# EAGLE design SOIC-28 v10 (EAGLE 6.2)
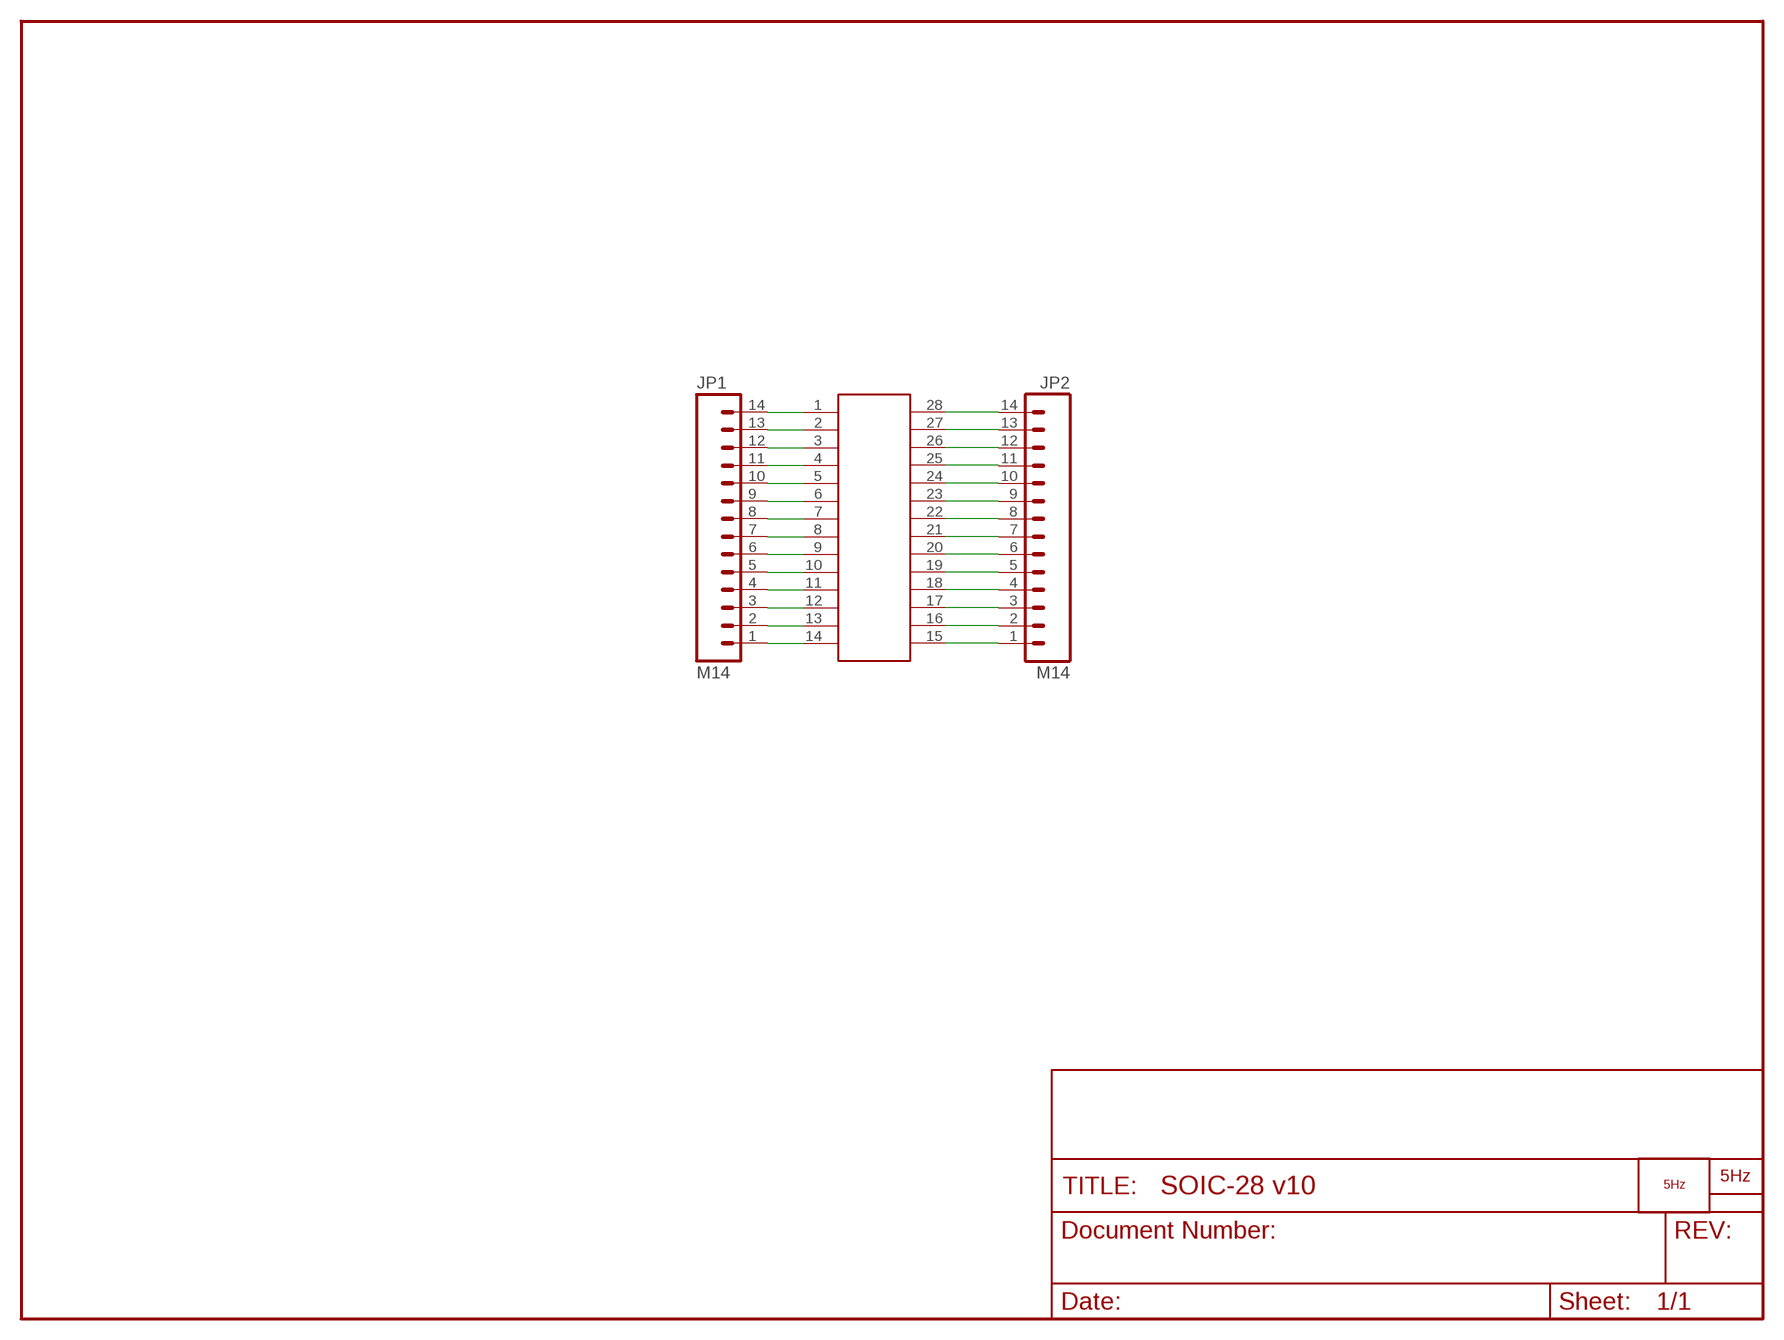
[diagram p0: schematic, sheet 1]

## Parts
JP1  M14  [1X14]
JP2  M14  [1X14]
LOGO1  LOGO_5HZ_MAIN_5MM  [5HZ_LOGO_MAIN_5MM]
U$1  SOIC-28SOIC-28  [SOIC-28]
U$2  LOGO2_SILK10MM  [LOGO2_10MM]

## Nets
N$1: JP1.1 U$1.14
N$2: JP1.2 U$1.13
N$3: JP1.3 U$1.12
N$4: JP1.4 U$1.11
N$5: JP1.5 U$1.10
N$6: JP1.6 U$1.9
N$7: JP1.7 U$1.8
N$8: JP1.8 U$1.7
N$9: JP1.9 U$1.6
N$10: JP1.10 U$1.5
N$11: JP1.11 U$1.4
N$12: JP1.12 U$1.3
N$13: JP1.13 U$1.2
N$14: JP1.14 U$1.1
N$15: JP2.1 U$1.15
N$16: JP2.2 U$1.16
N$17: JP2.3 U$1.17
N$18: JP2.4 U$1.18
N$19: JP2.5 U$1.19
N$20: JP2.6 U$1.20
N$21: JP2.7 U$1.21
N$22: JP2.8 U$1.22
N$23: JP2.9 U$1.23
N$24: JP2.10 U$1.24
N$25: JP2.11 U$1.25
N$26: JP2.12 U$1.26
N$27: JP2.13 U$1.27
N$28: JP2.14 U$1.28

## Library data of the parts
JP1 JP2 = SparkFun:M14: Header 14 Standard 14-pin 0.1" header. Use with straight break away headers (SKU : PRT-00116), right angle break away headers (PRT-00553), swiss pins (PRT-00743), machine pins (PRT-00117), and female headers (PRT-00115).
LOGO1 = 5hz-electronica:LOGO_5HZ: Logotipo 5Hz "según Pedro"
U$1 = MAÑE:SOIC-28
U$2 = LOGO:LOGO2_SILK: PRINCIPAL

## Board
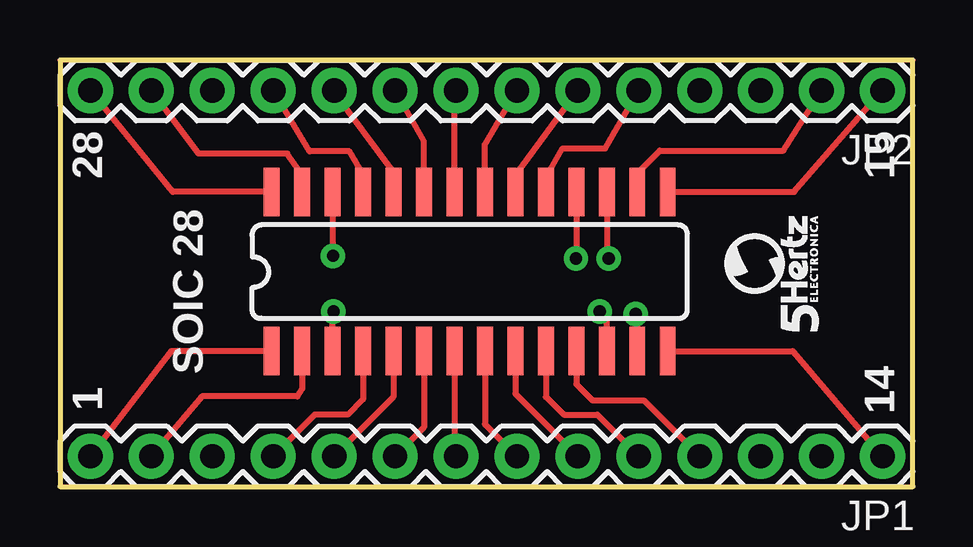
[diagram p1: board, top side]
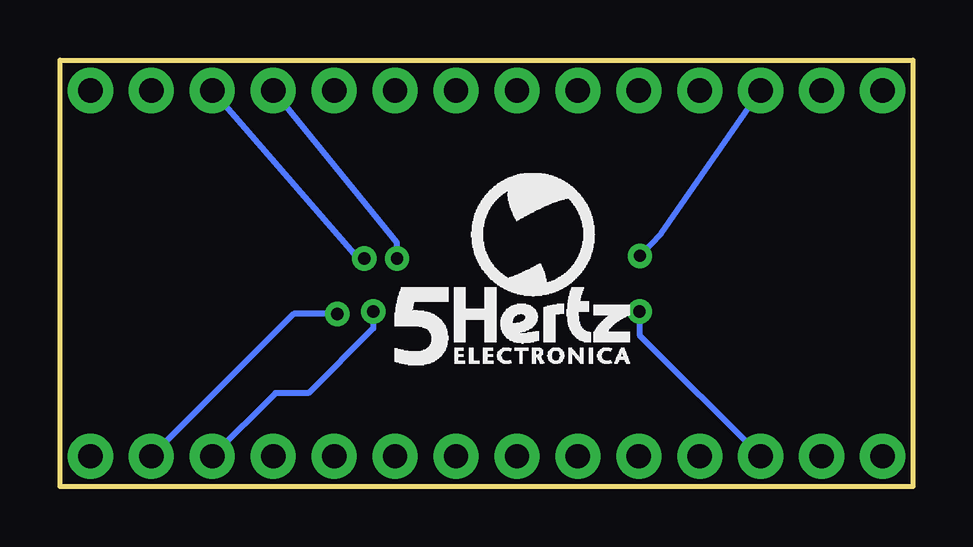
[diagram p2: board, bottom side, seen from below]

Size 35.56 x 17.78 mm. Coordinates in mm from the lower left corner, seen from the top.
Outline: 0,0 35.56,0 35.56,17.78 0,17.78 0,0
Copper layers (1*16): Top 0.035mm / dielectric 1.5mm / Bottom 0.035mm
Design rules: minimum track width 8mil, minimum drill 20mil, track to track 8mil, track to pad 8mil, pad to pad 8mil, via to via 8mil, smd to smd 8mil, copper to edge 10mil, drill to drill 8mil, minimum pad ring 12mil, minimum via ring 10mil, stop-mask expansion 4mil, vias tented up to drill 25mil, thermal gap 10mil

### Footprints (pad centres in the part's own frame; a part is rotated, then mirrored left to right if it is on the bottom)
1X14 = drill 1.016 pad 1.88: 1 0,0; 2 2.54,0; 3 5.08,0; 4 7.62,0; 5 10.16,0; 6 12.7,0; 7 15.24,0; 8 17.78,0; 9 20.32,0; 10 22.86,0; 11 25.4,0; 12 27.94,0; 13 30.48,0; 14 33.02,0
SOIC-28 = smd 0.66 x 2.032: 1 -7.685,-3.285; 2 -6.415,-3.285; 3 -5.145,-3.285; 4 -3.875,-3.285; 5 -2.605,-3.285; 6 -1.335,-3.285; 7 -0.065,-3.285; 8 1.205,-3.285; 9 2.475,-3.285; 10 3.745,-3.285; 11 5.015,-3.285; 12 6.285,-3.285; 13 7.555,-3.285; 14 8.825,-3.285; 15 8.825,3.345; 16 7.555,3.345; 17 6.285,3.345; 18 5.015,3.345; 19 3.745,3.345; 20 2.475,3.345; 21 1.205,3.345; 22 -0.065,3.345; 23 -1.335,3.345; 24 -2.605,3.345; 25 -3.875,3.345; 26 -5.145,3.345; 27 -6.415,3.345; 28 -7.685,3.345

### Placement (x,y rotation side)
JP1  34.29,1.27 180 top
JP2  34.29,16.51 180 top
LOGO1  31.62,6.48 90 top
U$1  16.51,8.94 0 top
U$2  21.59,5.08 0 bottom

### Tracks (layer width: path | path; a pad name or v marks a point on that pad's centre or on a via)
N$1
  Top 0.254: U$1.14 30.54,5.65 JP1.1
N$2  (via drill 0.51)
  Top 0.254: U$1.13 24.07,7.13 v24,7.2
  Bottom 0.254: v24,7.2 25.82,7.2 JP1.2
N$3  (via drill 0.51)
  Top 0.254: U$1.12 22.8,7 v22.5,7.3
  Bottom 0.254: v22.5,7.3 22.5,6.6 25.2,3.9 26.58,3.9 JP1.3
N$4
  Top 0.254: U$1.11 21.52,4.28 22.2,3.6 24.34,3.6 JP1.4
N$5
  Top 0.254: U$1.10 20.25,3.75 21,3 22.4,3 JP1.5
N$6
  Top 0.254: U$1.9 18.98,3.88 JP1.6
N$7
  Top 0.254: U$1.8 17.71,2.6 JP1.7
N$8
  Top 0.254: U$1.7 16.45,1.33 JP1.8
N$9
  Top 0.254: U$1.6 15.18,2.48 JP1.9
N$10
  Top 0.254: U$1.5 13.9,3.75 JP1.10
N$11
  Top 0.254: U$1.4 12.63,3.63 12,3 10.62,3 JP1.11
N$12  (via drill 0.51)
  Top 0.254: U$1.3 11.37,7.26 v11.4,7.3
  Bottom 0.254: v11.4,7.3 11.4,6.32 JP1.12
N$13
  Top 0.254: U$1.2 10.1,4.09 9.89,3.76 5.92,3.76 JP1.13
N$14
  Top 0.254: U$1.1 4.64,5.65 JP1.14
N$15
  Top 0.254: U$1.15 30.6,12.28 JP2.1
N$16
  Top 0.254: U$1.16 24.07,13.06 25,14 30.16,14 JP2.2
N$17  (via drill 0.51)
  Top 0.254: U$1.17 22.8,9.21 v22.87,9.51
  Bottom 0.254: v22.87,9.51 23,9.38 JP2.3
N$18  (via drill 0.51)
  Top 0.254: U$1.18 21.52,9.53 v21.51,9.51
  Bottom 0.254: v21.51,9.51 21.51,10.17 JP2.4
N$19
  Top 0.254: U$1.19 20.25,12.89 20.95,14.1 22.73,14.1 JP2.5
N$20
  Top 0.254: U$1.20 18.98,12.98 JP2.6
N$21
  Top 0.254: U$1.21 17.71,14.26 JP2.7
N$22
  Top 0.254: U$1.22 16.45,15.53 JP2.8
N$23
  Top 0.254: U$1.23 15.18,14.38 JP2.9
N$24
  Top 0.254: U$1.24 13.9,13.1 11.37,16.52 11.37,16.54 JP2.10
N$25
  Top 0.254: U$1.25 12.63,13.02 12.06,13.97 10.41,13.97 JP2.11
N$26  (via drill 0.51)
  Top 0.254: U$1.26 11.37,10.37 v11.38,9.62
  Bottom 0.254: v11.38,9.62 10.49,10.56 JP2.12
N$27
  Top 0.254: U$1.27 10.1,13.01 9.47,13.88 5.77,13.88 JP2.13
N$28
  Top 0.254: U$1.28 4.7,12.28 JP2.14

### Text on the board
tPlace: 28 | 15 | SOIC 28 | 1 | 14